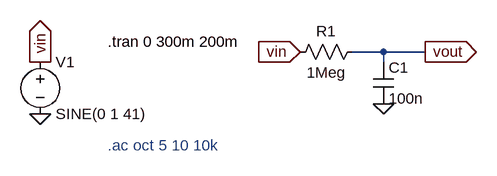
[diagram p0: schematic phase-shift.asc]
phase-shift.asc, the LTspice schematic file:
Version 4
SHEET 1 880 680
WIRE 320 272 272 272
WIRE 384 272 320 272
WIRE 320 288 320 272
FLAG -208 368 0
FLAG -208 288 vin
IOPIN -208 288 Out
FLAG 192 272 vin
IOPIN 192 272 In
FLAG 320 352 0
FLAG 384 272 vout
IOPIN 384 272 Out
SYMBOL Voltage -208 272 R0
SYMATTR InstName V1
SYMATTR Value SINE(0 1 41)
SYMATTR Value2 AC 1
SYMBOL Res 288 256 R90
WINDOW 0 0 56 VBottom 2
WINDOW 3 32 56 VTop 2
SYMATTR InstName R1
SYMATTR Value 1Meg
SYMBOL Cap 304 288 R0
SYMATTR InstName C1
SYMATTR Value 100n
TEXT -104 256 Left 2 !.tran 0 300m 200m
TEXT -104 416 Left 2 ;.ac oct 5 10 10k

The netlist it stands for:
* phase-shift.asc
V1 vin 0 SINE(0 1 41) AC 1
R1 vout vin 1Meg
C1 vout 0 100n
.tran 0 300m 200m
* .ac oct 5 10 10k
.backanno
.end